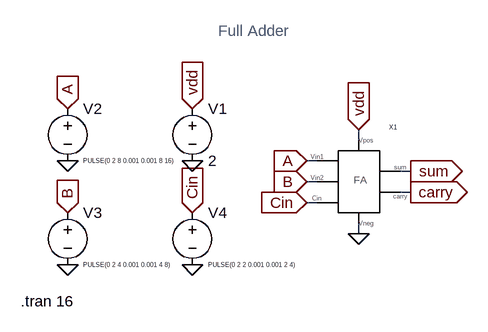
[diagram p0: schematic FA block.asc]
FA block.asc, the LTspice schematic file:
Version 4
SHEET 1 880 680
WIRE 320 96 320 80
WIRE 256 128 240 128
WIRE 400 144 384 144
WIRE 256 160 240 160
WIRE 400 176 384 176
WIRE 256 192 240 192
WIRE 320 240 320 224
FLAG 64 48 vdd
IOPIN 64 48 In
FLAG 320 80 vdd
IOPIN 320 80 In
FLAG 240 128 A
IOPIN 240 128 In
FLAG -128 48 A
IOPIN -128 48 In
FLAG 240 160 B
IOPIN 240 160 In
FLAG -128 208 B
IOPIN -128 208 In
FLAG 240 192 Cin
IOPIN 240 192 In
FLAG 64 208 Cin
IOPIN 64 208 In
FLAG 320 240 0
FLAG 64 288 0
FLAG -128 288 0
FLAG -128 128 0
FLAG 64 128 0
FLAG 400 144 sum
IOPIN 400 144 Out
FLAG 400 176 carry
IOPIN 400 176 Out
SYMBOL fa 352 160 R0
SYMATTR InstName X1
SYMBOL voltage 64 32 R0
WINDOW 123 0 0 Left 0
WINDOW 39 0 0 Left 0
SYMATTR InstName V1
SYMATTR Value 2
SYMBOL voltage -128 32 R0
WINDOW 3 24 96 Left 0
WINDOW 123 0 0 Left 0
WINDOW 39 0 0 Left 0
SYMATTR InstName V2
SYMATTR Value PULSE(0 2 8 0.001 0.001 8 16)
SYMBOL voltage -128 192 R0
WINDOW 3 24 96 Left 0
WINDOW 123 0 0 Left 0
WINDOW 39 0 0 Left 0
SYMATTR InstName V3
SYMATTR Value PULSE(0 2 4 0.001 0.001 4 8)
SYMBOL voltage 64 192 R0
WINDOW 3 24 96 Left 0
WINDOW 123 0 0 Left 0
WINDOW 39 0 0 Left 0
SYMATTR InstName V4
SYMATTR Value PULSE(0 2 2 0.001 0.001 2 4)
TEXT -200 344 Left 2 !.tran 16
TEXT 104 -72 Left 2 ;Full Adder

The netlist it stands for:
* FA block.asc
XX1 A B Cin sum carry vdd 0 fa  ; pins A B Cin sum carry vdd gnd
V1 vdd 0 2
V2 A 0 PULSE(0 2 8 0.001 0.001 8 16)
V3 B 0 PULSE(0 2 4 0.001 0.001 4 8)
V4 Cin 0 PULSE(0 2 2 0.001 0.001 2 4)
.tran 16
* Full Adder
.backanno
.end